# Altium schematic sheet board_4_pg2.SchDoc
size Legal; SheetNumber: 2; SheetTotal: 2
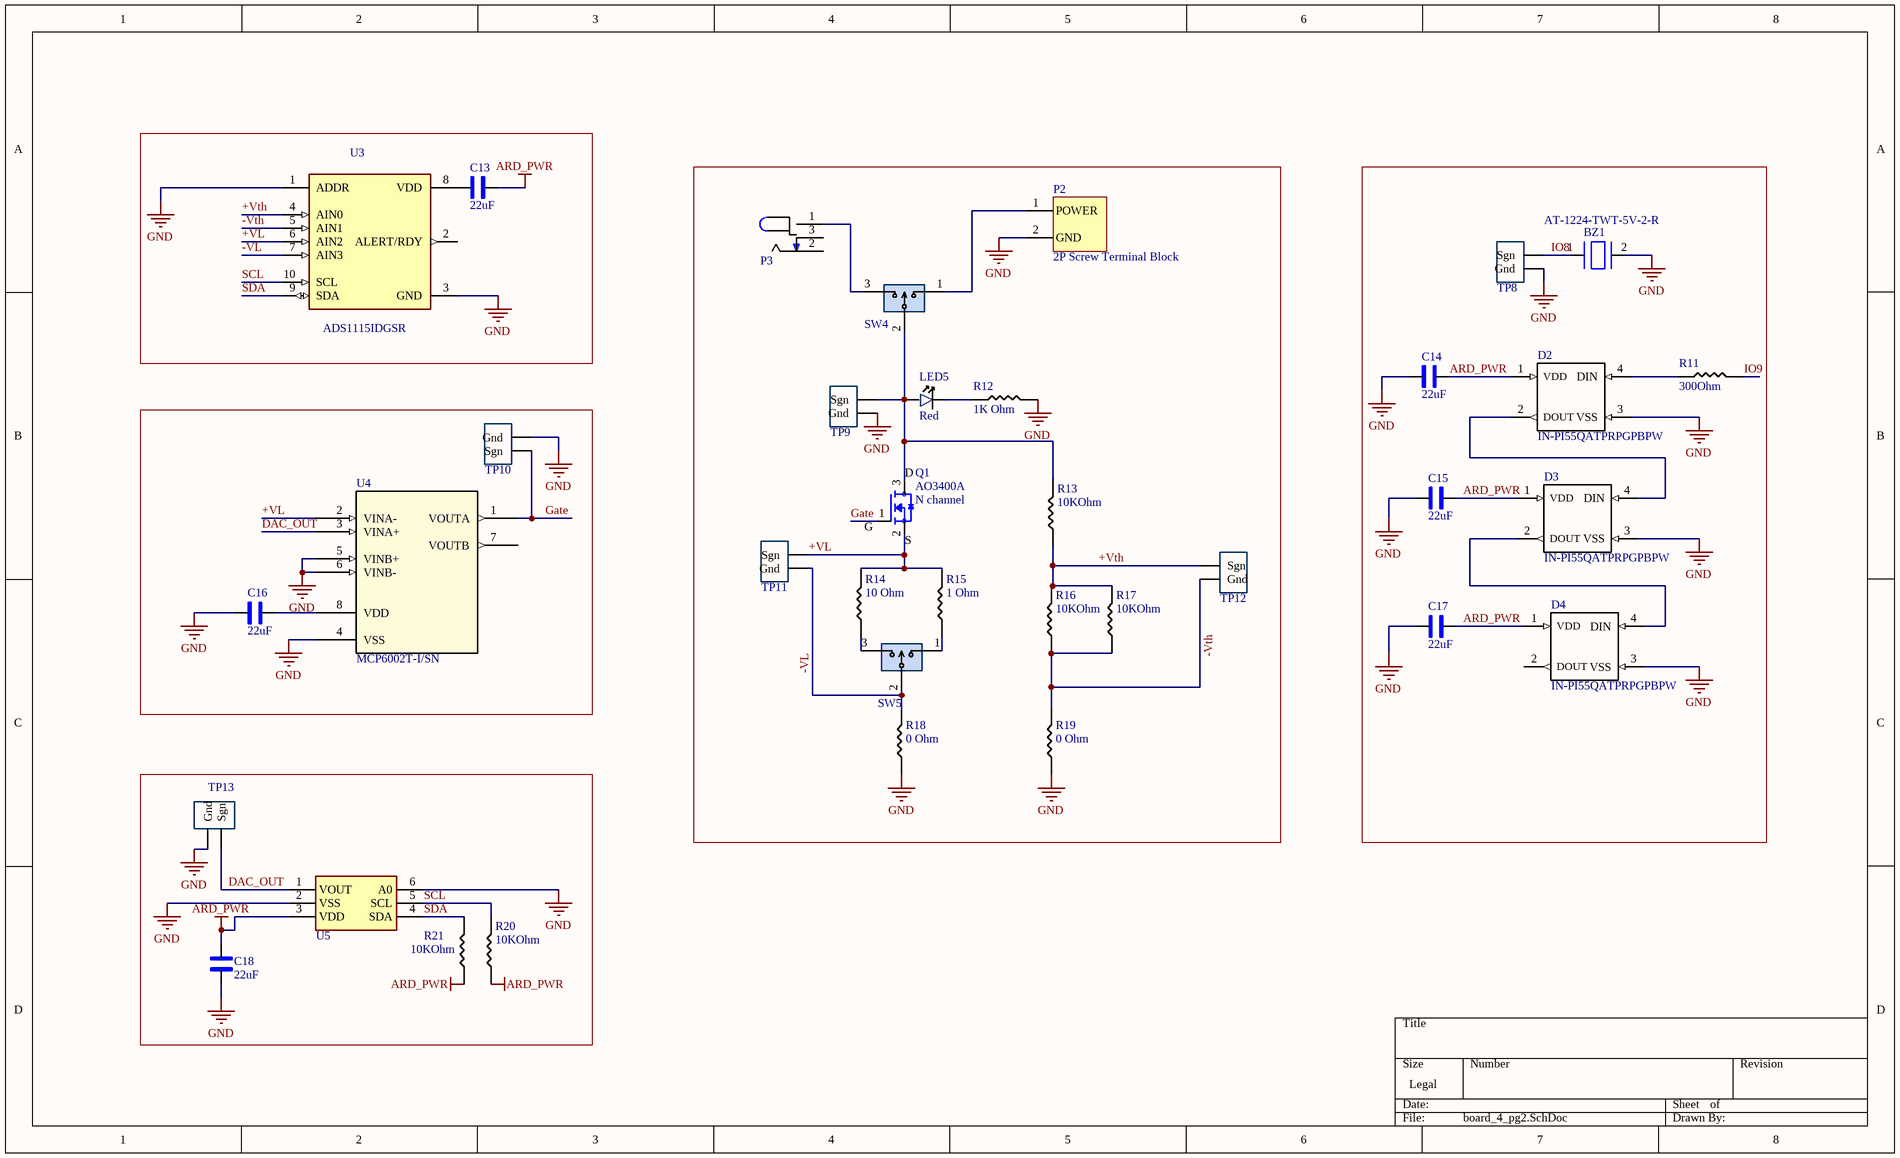
[diagram p0: board_4_pg2.SchDoc]

## Parts
BZ1  AT-1224-TWT-5V-2-R  [BUZZER- TH]
C13  22uF  [1206_Passive_Capacitor]
C14  22uF  [1206_Passive_Capacitor]
C15  22uF  [1206_Passive_Capacitor]
C16  22uF  [1206_Passive_Capacitor]
C17  22uF  [1206_Passive_Capacitor]
C18  22uF  [1206_Passive_Capacitor]
D2  IN-PI55QATPRPGPBPW  [SERIAL_LED - duplicate]
D3  IN-PI55QATPRPGPBPW  [SERIAL_LED - duplicate]
D4  IN-PI55QATPRPGPBPW  [SERIAL_LED - duplicate]
LED5  Red  [LED_1206]
P2  2P Screw Terminal Block  [P_Terminal block 3.5mm-pitch]
P3  Power Jack  [Power_Jack]  (value not drawn)
Q1  AO3400A  value N channel  [N-MOSFET]
R11  value 300Ohm  [1206_Passive_Resitor]  (hidden comment: 300 Ohm)
R12  value 1K Ohm  [1206_Passive_Resitor]  (hidden comment: 1k)
R13  value 10KOhm  [1206_Passive_Resitor]  (hidden comment: 10k)
R14  10 Ohm  [1206_Passive_Resitor]
R15  value 1 Ohm  [1206_Passive_Resitor]  (hidden comment: 10 Ohm)
R16  value 10KOhm  [1206_Passive_Resitor]  (hidden comment: 10k)
R17  value 10KOhm  [1206_Passive_Resitor]  (hidden comment: 10k)
R18  0 Ohm  [1206_Passive_Resitor]
R19  0 Ohm  [1206_Passive_Resitor]
R20  value 10KOhm  [1206_Passive_Resitor]  (hidden comment: 10k)
R21  value 10KOhm  [1206_Passive_Resitor]  (hidden comment: 10k)
SW4  PREC003SAAN-RC  [3_PIN_100mil]  (value not drawn)
SW5  PREC003SAAN-RC  [3_PIN_100mil]  (value not drawn)
TP8  10x Probe TP  [TP10x_Probe]  (value not drawn)
TP9  10x Probe TP  [TP10x_Probe]  (value not drawn)
TP10  10x Probe TP  [TP10x_Probe]  (value not drawn)
TP11  10x Probe TP  [TP10x_Probe]  (value not drawn)
TP12  10x Probe TP  [TP10x_Probe]  (value not drawn)
TP13  10x Probe TP  [TP10x_Probe]  (value not drawn)
U3  ADS1115IDGSR  [ADC_ADS1115IDGSR]
U4  MCP6002T-I/SN  [SOIC127P600X175-8N]
U5  DAC IC  [MCP4725]  (value not drawn)

## Nets
ARD_PWR: C13.1 C14.1 C15.1 C17.1 C18.2 D2.1(VDD) D3.1(VDD) D4.1(VDD) R20.1 R21.1 U5.3(VDD)
GND: BZ1.2(BZ2) C14.2 C15.2 C16.2 C17.2 C18.1 D2.3(VSS) D3.3(VSS) D4.3(VSS) P2.2(GND) R12.2 R18.1 R19.1 TP8.2(Gnd) TP9.2(Gnd) TP10.2(Gnd) TP13.2(Gnd) U3.1(ADDR) U3.3(GND) U4.4(VSS) U4.5(VINB+) U4.6(VINB-) U5.2(VSS) U5.6(A0)
+VL: Q1.2(S) R14.2 R15.2 TP11.1(Sgn) U3.6(AIN2) U4.2(VINA-)
+Vth: R13.1 R16.2 R17.2 TP12.1(Sgn) U3.4(AIN0)
-VL: R18.2 SW5.2 TP11.2(Gnd) U3.7(AIN3)
-Vth: R16.1 R17.1 R19.2 TP12.2(Gnd) U3.5(AIN1)
DAC_OUT: TP13.1(Sgn) U4.3(VINA+) U5.1(VOUT)
Gate: Q1.1(G) TP10.1(Sgn) U4.1(VOUTA)
IO8: BZ1.1(BZ1) TP8.1(Sgn)
IO9: R11.2
SCL: R20.2 U3.10(SCL) U5.5(SCL)
SDA: R21.2 U3.9(SDA) U5.4(SDA)
NetC13_2: C13.2 U3.8(VDD)
NetC16_1: C16.1 U4.8(VDD)
NetD2_2: D2.2(DOUT) D3.4(DIN)
NetD2_4: D2.4(DIN) R11.1
NetD3_2: D3.2(DOUT) D4.4(DIN)
NetLED5_1: LED5.1 Q1.3(D) R13.2 SW4.2 TP9.1(Sgn)
NetLED5_2: LED5.2 R12.1
NetP2_1: P2.1(POWER) SW4.1
NetP3_1: P3.1 SW4.3
NetR14_1: R14.1 SW5.3
NetR15_1: R15.1 SW5.1

Not connected (* = marked no-connect by the designer): D4 2(DOUT); P3 2 3; U3 2(ALERT/RDY); U4 7(VOUTB)

## Library data of the parts
BZ1 = BUZZER_1: Buzzers Transducer, Externally Driven Electromechanical/Magnetic 5 V 40mA 2.4kHz 87dB @ 5V, 10cm Through Hole PC Pins; Datasheet: https://www.puiaudio.com/media/SpecSheet/AT-1224-TWT-5V-2-R.pdf; MFR Part #: AT-1224-TWT-5V-2-R
C13-C18 = C_22uF_1206: 22uF ±10% 25V X5R 1206 Multilayer Ceramic Capacitors MLCC - SMD/SMT RoHS; MFR Part #: CL31A226KAHNNNE; Type: basic; LCSC Part#: C12891; Datasheet: https://datasheet.lcsc.com/lcsc/1811031514_Samsung-Electro-Mechanics-CL31A226KAHNNNE_C12891.pdf; Value: 22uF
D2-D4 = LED_Smart: LIGHT EMITTING DIODES (LED) RGB 620~630NM RED, 520~530NM GREEN, 465~475NM BLUE 600MCD@16MARED,1200MCD@16MAGREEN,300MCD@16MABLUE TOP VIEW SMD-4 ROHS; MFR Part #: XL-5050RGBC-WS2812B; Manufacturer: XINGLIGHT; LCSC Part#: C2843785; DataSheet: https://datasheet.lcsc.com/lcsc/2301111130_XINGLIGHT-XL-5050RGBC-WS2812B_C2843785.pdf
LED5 = LED_RED_1206: Red 621~631nm 1206 Light Emitting Diodes (LED) RoHS; MFR Part #: 15-21/R6C-FQ1R1B/2T; Type: Extended; LCSC Part#: C93133; Datasheet: https://datasheet.lcsc.com/szlcsc/1811151241_Everlight-Elec-15-21-R6C-FQ1R1B-2T_C93133.pdf; Value: Red
P2 = P_Terminal block: Green Straight pin 3.5mm  pitch; P=3.5mm  Screw terminal ROHS; MFR Part #: KF350-3.5-2P; Manufacturer: Cixi Kefa Elec; LCSC Part#: C474892; DataSheet: https://datasheet.lcsc.com/lcsc/2001160007_Cixi-Kefa-Elec-KF350-3-5-2P_C474892.pdf
P3 = P_Power Jack: Power Barrel Connector Jack 2.10mm ID (0.083"), 5.50mm OD (0.217") Through Hole, Right Angle; MFR Part #: PJ-102A; Value: CONN PWR JACK 2X5.5MM SOLDER; Digikey Link: https://www.digikey.com/product-detail/en/PJ-102A/CP-102A-ND/275425/?itemSeq=304982367; LCSC Part#: C136744; Type: Extended
Q1 = Q_Nch_MOSFET: MOSFET N Trench 30V 5.7A 1.5V @ 250uA 26.5 m? @ 5.7A,10V SOT-23-3L RoHS; Type: Basic; LCSC Part#: C20917; Datasheet: https://datasheet.lcsc.com/szlcsc/Alpha-Omega-Semicon-AOS-AO3400A_C20917.pdf; MFR Part #: AO3400A
R11 = R_300Ohm_1206: CHIP RESISTOR - SURFACE MOUNT 300OHMS ±1% 1/4W 1206 ROHS; MFR Part #: 1206W4F3000T5E; Datasheet: https://datasheet.lcsc.com/szlcsc/Uniroyal-Elec-1206W4F3000T5E_C17887.pdf; LCSC Part#: C17887; Type: Basic
R12 = R_1K_1206: CHIP RESISTOR - SURFACE MOUNT 1KOHMS ±1% 1/4W 1206 ROHS; MFR Part #: RNCP1206FTD1K00CT; Digikey Link: https://www.digikey.com/product-detail/en/RNCP1206FTD1K00/RNCP1206FTD1K00CT-ND/2240675/?itemSeq=304982373; LCSC Part#: C4410; Type: Basic
R13 R16 R17 R20 R21 = R_10KOhm_1206: 10 kOhms ±5% 0.25W, 1/4W Chip Resistor 1206 (3216 Metric) Automotive AEC-Q200 Thick Film; MFR Part #: RMCF1206FT10K0; Digikey Link: https://www.digikey.com/en/products/detail/stackpole-electronics-inc/RMCF1206FT10K0/1759669; LCSC Part#: C17902; Type: Basic
R14 R15 = R_10Ohm_1206: CHIP RESISTOR - SURFACE MOUNT 0.1OHMS ±1% 1/4W 1206 ROHS; MFR Part #: 1206W4F100JT5E; Datasheet: https://datasheet.lcsc.com/szlcsc/Uniroyal-Elec-1206W4F100JT5E_C17903.pdf; LCSC Part#: C17903; Type: Basic
  R14: Value: 10 Ohm
R18 R19 = R_0Ohm_1206: CHIP RESISTOR - SURFACE MOUNT 0OHMS ±1% 1/4W 1206 ROHS; MFR Part #: 1206W4F0000T5E; Datasheet: https://datasheet.lcsc.com/szlcsc/Uniroyal-Elec-1206W4F0000T5E_C17888.pdf; LCSC Part#: C17888; Type: Basic; Mouser link: https://www.mouser.com/ProductDetail/Royalohm/1206W4F0000T5E?qs=e8oIoAS2J1Thbopin%252BsagQ%3D%3D; Value: 0 Ohm
SW4 SW5 = SW_3Pin_100mil_Switch: Connector Header Through Hole 3 position 0.100" (2.54mm); Value: CONN HEADER VERT 3POS 2.54MM; Digikey Link: https://www.digikey.com/product-detail/en/PREC003SAAN-RC/S1012EC-03-ND/2774851/?itemSeq=304982371; MFR Part #: PREC003SAAN-RC; Type: Extended; LCSC Part#: C49257
TP8-TP13 = TP_10x_Probe: Test Point 300 mil centers
U3 = U_ADC_ADS1115IDGSR: 16-Bit ADC with Integrated MUX, PGA, Comparator, Oscillator, and Reference 10-VSSOP -40 to 125; MFR Part #: ADS1115IDGSR; Package: MSOP-10 Texas Instruments; LCSC Part#: C37593; SnapEDA_Link: https://www.snapeda.com/parts/ADS1115IDGSR/Texas%20Instruments/view-part/?ref=snap; Type: Extended; DigiKey link: https://www.digikey.com/product-detail/en/texas-instruments/ADS1115IDGSR/296-38849-1-ND/5142969?utm_source=snapeda&utm_medium=aggregator&utm_campaign=symbol; Value: *
U4 = U_MCP6002T-I/SN: 0.6 V/us 2 1MHz 1.8V ~ 6V 100μA General Purpose SOIC-8_150mil  Operational Amplifier ROHS; Mfr: Microchip; MFR Part #: MCP6002T-I/SN; DataSheet: https://ww1.microchip.com/downloads/en/DeviceDoc/MCP6001-1R-1U-2-4-1-MHz-Low-Power-Op-Amp-DS20001733L.pdf; LCSC Part#: C7377; Type: Basic
U5 = U_MCP4725A0T-E/CH: IC DAC 12BIT V-OUT SOT23-6; Datasheet: https://ww1.microchip.com/downloads/en/DeviceDoc/22039d.pdf; LCSC Part#: C144198; type: Extended; MFR Part #: MCP4725A0T-E/CH